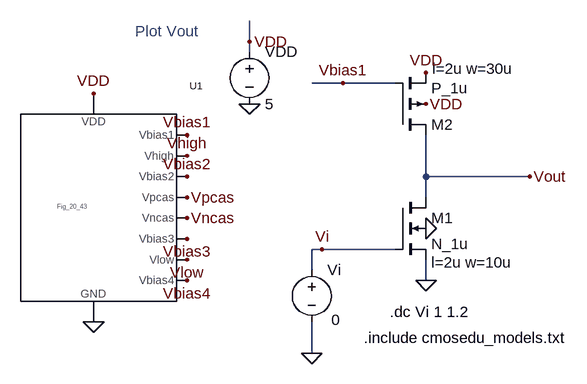
[diagram p0: schematic Fig21_17.asc]
Fig21_17.asc, the LTspice schematic file:
Version 4
SHEET 1 1784 680
WIRE 1040 -320 1040 -352
WIRE 1040 -304 1040 -320
WIRE 1184 -256 1136 -256
WIRE 1264 -256 1184 -256
WIRE 1312 -112 1312 -176
WIRE 1472 -112 1312 -112
WIRE 1312 -80 1312 -112
WIRE 1152 0 1136 0
WIRE 1264 0 1152 0
WIRE 1136 32 1136 0
WIRE 1312 48 1312 16
WIRE 1136 160 1136 112
FLAG 1040 -224 0
FLAG 1040 -320 VDD
FLAG 1312 -32 0
FLAG 1312 48 0
FLAG 1312 -272 VDD
FLAG 1312 -224 VDD
FLAG 800 -240 VDD
FLAG 800 112 0
FLAG 944 -176 Vbias1
FLAG 944 -144 Vhigh
FLAG 944 -112 Vbias2
FLAG 944 -16 Vbias3
FLAG 944 -80 Vpcas
FLAG 944 -48 Vncas
FLAG 944 48 Vbias4
FLAG 944 16 Vlow
FLAG 1472 -112 Vout
FLAG 1136 160 0
FLAG 1152 0 Vi
FLAG 1184 -256 Vbias1
SYMBOL voltage 1040 -320 R0
WINDOW 123 0 0 Left 2
WINDOW 39 0 0 Left 2
SYMATTR InstName VDD
SYMATTR Value 5
SYMBOL nmos4 1264 -80 R0
WINDOW 123 56 100 Left 2
SYMATTR Value2 l=2u w=10u
SYMATTR InstName M1
SYMATTR Value N_1u
SYMBOL pmos4 1264 -176 M180
WINDOW 123 58 102 Left 2
WINDOW 0 56 16 Left 2
SYMATTR Value2 l=2u w=30u
SYMATTR InstName M2
SYMATTR Value P_1u
SYMBOL Fig_20_43 800 -64 R0
SYMATTR InstName U1
SYMBOL voltage 1136 16 R0
WINDOW 123 24 132 Left 2
WINDOW 39 0 0 Left 2
WINDOW 3 30 93 Left 2
SYMATTR Value 0
SYMATTR InstName Vi
TEXT 1216 136 Left 2 !.include cmosedu_models.txt
TEXT 864 -336 Left 2 ;Plot Vout
TEXT 1256 96 Left 2 !.dc Vi 1 1.2

The netlist it stands for:
* Fig21_17.asc
VDD VDD 0 5
M1 Vout Vi 0 0 N_1u l=2u w=10u
M2 Vout Vbias1 VDD VDD P_1u l=2u w=30u
XU1 Vbias1 Vhigh Vbias2 Vpcas Vncas Vbias3 Vlow Vbias4 VDD 0 Fig_20_43  ; pins Vbias1 Vhigh Vbias2 Vpcas Vncas Vbias3 Vlow Vbias4 VDD GND
Vi Vi 0 0
.model NMOS NMOS
.model PMOS PMOS
.lib standard.mos
.include cmosedu_models.txt
* Plot Vout
.dc Vi 1 1.2
.backanno
.end